# Altium schematic sheet Micro SD Card Holder.schdoc
size 62 x 58 mm
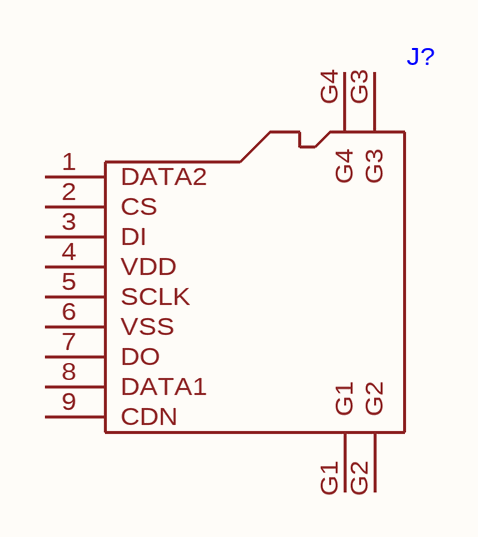
[diagram p0: Micro SD Card Holder.schdoc]

## Parts
J?  (no value)  [MICRO-SD9+4P-SMD-16.1X14.5X1.85MM]

## Nets

Not connected (* = marked no-connect by the designer): J? 1(DATA2) 2(CS) 3(DI) 4(VDD) 5(SCLK) 6(VSS) 7(DO) 8(DATA1) 9(CDN) G1 G2 G3 G4

## Library data of the parts
J? = Micro SD Card Holder;